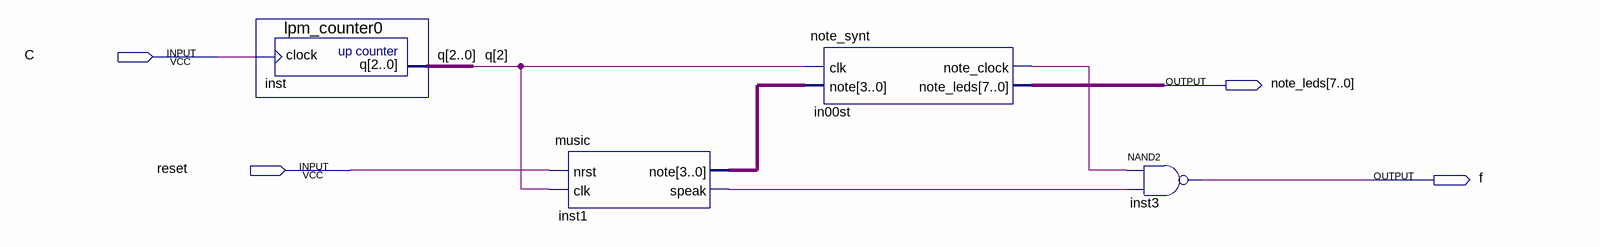
[diagram p0: schematic sheet]
// Quartus schematic music_project.bdf as structural Verilog: 4 symbols, 4 pins
module music_project (
  input  C,
  input  reset,
  output [7:0] note_leds,
  output f
);

  wire in00st_note_clock, inst1_speak;
  wire [2:0] q;
  wire [3:0] inst1_note;

  lpm_counter0 inst (.clock(C), .q(q));
  music inst1 (.nrst(reset), .clk(q[2]), .note(inst1_note), .speak(inst1_speak));
  note_synt in00st (.clk(q[2]), .note(inst1_note), .note_clock(in00st_note_clock), .note_leds(note_leds));
  nand inst3 (f, in00st_note_clock, inst1_speak);
endmodule
